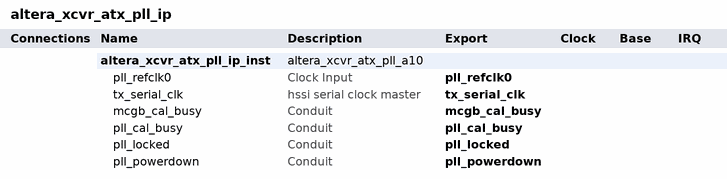
[diagram p0: system contents]
# Platform Designer (Qsys) system altera_xcvr_atx_pll_ip, Arria 10 10AX115U1F45I1SG
# Parameters at their usual value, and those the tool derives, are not listed.
package require -exact qsys 16.0
create_system altera_xcvr_atx_pll_ip
set_project_property DEVICE_FAMILY {Arria 10}
set_project_property DEVICE 10AX115U1F45I1SG

add_instance altera_xcvr_atx_pll_ip_inst altera_xcvr_atx_pll_a10 16.0
set_instance_property altera_xcvr_atx_pll_ip_inst AUTO_EXPORT true
set_instance_parameter_value altera_xcvr_atx_pll_ip_inst base_device NIGHTFURY5
set_instance_parameter_value altera_xcvr_atx_pll_ip_inst bw_sel high
set_instance_parameter_value altera_xcvr_atx_pll_ip_inst enable_analog_resets 0
set_instance_parameter_value altera_xcvr_atx_pll_ip_inst enable_bonding_clks 0
set_instance_parameter_value altera_xcvr_atx_pll_ip_inst enable_ext_lockdetect_ports 0
set_instance_parameter_value altera_xcvr_atx_pll_ip_inst enable_manual_configuration 1
set_instance_parameter_value altera_xcvr_atx_pll_ip_inst enable_mcgb 0
set_instance_parameter_value altera_xcvr_atx_pll_ip_inst enable_pld_mcgb_cal_busy_port 1
set_instance_parameter_value altera_xcvr_atx_pll_ip_inst generate_docs 1
set_instance_parameter_value altera_xcvr_atx_pll_ip_inst pma_width 64
set_instance_parameter_value altera_xcvr_atx_pll_ip_inst rcfg_enable_avmm_busy_port 0
set_instance_parameter_value altera_xcvr_atx_pll_ip_inst rcfg_file_prefix altera_xcvr_atx_pll_vi
set_instance_parameter_value altera_xcvr_atx_pll_ip_inst rcfg_reduced_files_enable 0
set_instance_parameter_value altera_xcvr_atx_pll_ip_inst rcfg_separate_avmm_busy 0
set_instance_parameter_value altera_xcvr_atx_pll_ip_inst set_auto_reference_clock_frequency 644.53125
set_instance_parameter_value altera_xcvr_atx_pll_ip_inst set_fref_clock_frequency 100.0
set_instance_parameter_value altera_xcvr_atx_pll_ip_inst set_k_counter 1
set_instance_parameter_value altera_xcvr_atx_pll_ip_inst set_l_cascade_counter 15
set_instance_parameter_value altera_xcvr_atx_pll_ip_inst set_l_cascade_predivider 1
set_instance_parameter_value altera_xcvr_atx_pll_ip_inst set_l_counter 2
set_instance_parameter_value altera_xcvr_atx_pll_ip_inst set_m_counter 1
set_instance_parameter_value altera_xcvr_atx_pll_ip_inst set_manual_reference_clock_frequency 100.0
set_instance_parameter_value altera_xcvr_atx_pll_ip_inst set_output_clock_frequency 5156.25
set_instance_parameter_value altera_xcvr_atx_pll_ip_inst set_rcfg_emb_strm_enable 0

# exported interfaces
add_interface mcgb_cal_busy conduit end
set_interface_property mcgb_cal_busy EXPORT_OF altera_xcvr_atx_pll_ip_inst.mcgb_cal_busy
add_interface pll_cal_busy conduit end
set_interface_property pll_cal_busy EXPORT_OF altera_xcvr_atx_pll_ip_inst.pll_cal_busy
add_interface pll_locked conduit end
set_interface_property pll_locked EXPORT_OF altera_xcvr_atx_pll_ip_inst.pll_locked
add_interface pll_powerdown conduit end
set_interface_property pll_powerdown EXPORT_OF altera_xcvr_atx_pll_ip_inst.pll_powerdown
add_interface pll_refclk0 clock sink
set_interface_property pll_refclk0 EXPORT_OF altera_xcvr_atx_pll_ip_inst.pll_refclk0
add_interface tx_serial_clk hssi_serial_clock start
set_interface_property tx_serial_clk EXPORT_OF altera_xcvr_atx_pll_ip_inst.tx_serial_clk

set_interconnect_requirement {$system} qsys_mm.clockCrossingAdapter HANDSHAKE
set_interconnect_requirement {$system} qsys_mm.insertDefaultSlave FALSE
set_interconnect_requirement {$system} qsys_mm.maxAdditionalLatency 1

save_system altera_xcvr_atx_pll_ip.qsys
